# EAGLE schematic pic32ak_fe (EAGLE 9.6.2)
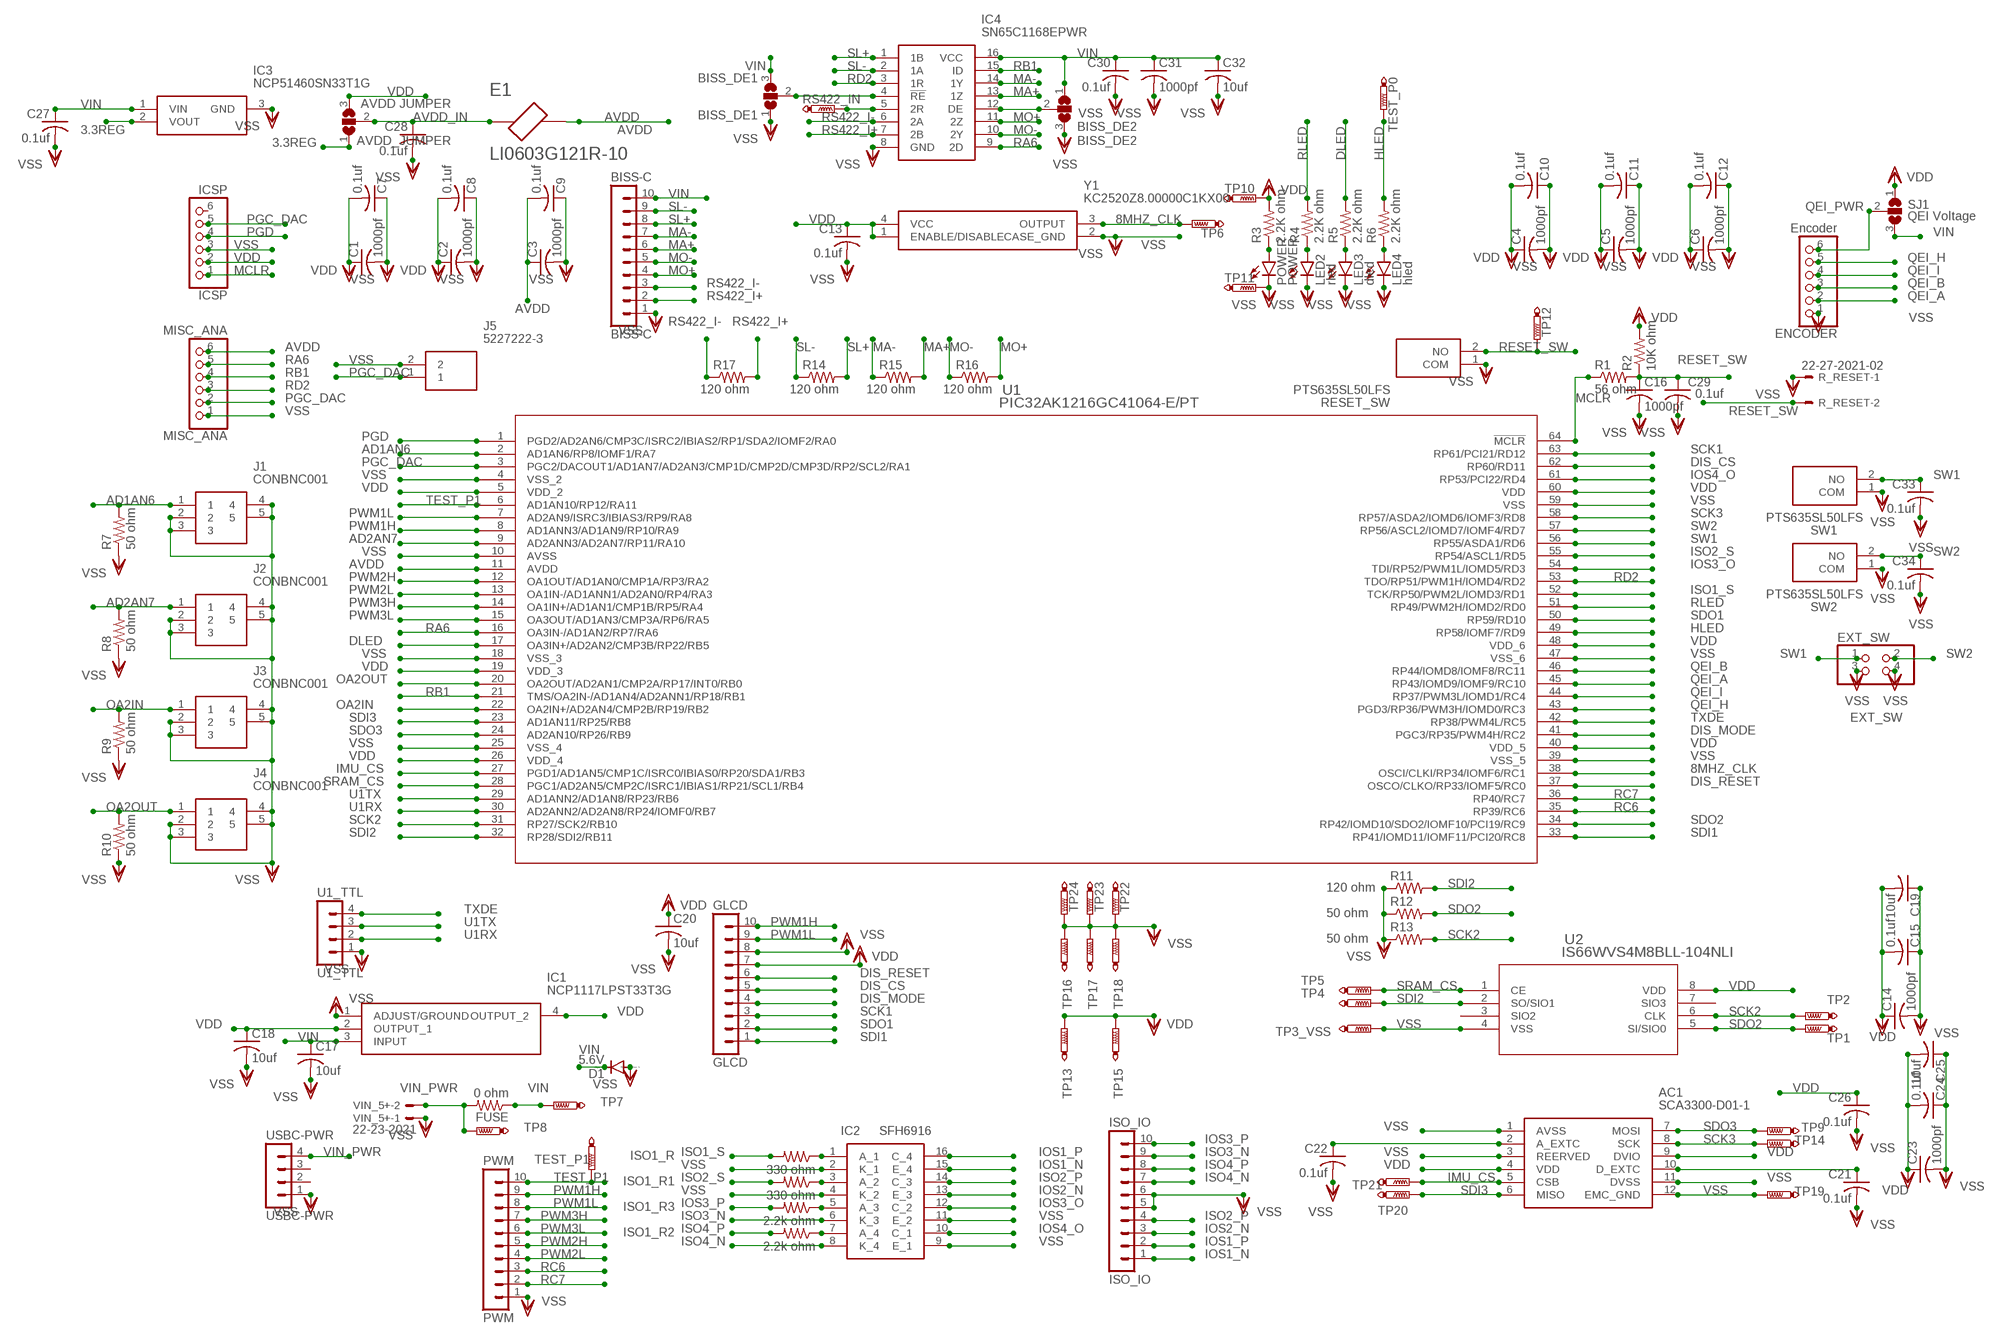
[diagram p0: schematic, sheet 1]

## Parts
AC1  SCA3300-D01-1  [SCA3300]
AVDD_JUMPER  AVDD JUMPER  SJ2W  [SJ_2]
BISS-C  BISS-C  MA10-1  [MA10-1]
BISS_DE1  BISS_DE1  SJ2W  [SJ_2]
BISS_DE2  BISS_DE2  SJ2W  [SJ_2]
C1  1000pf  C-USC0603  [C0603]
C2  1000pf  C-USC0603  [C0603]
C3  1000pf  C-USC0603  [C0603]
C4  1000pf  C-USC0603  [C0603]
C5  1000pf  C-USC0603  [C0603]
C6  1000pf  C-USC0603  [C0603]
C7  0.1uf  C-USC0603  [C0603]
C8  0.1uf  C-USC0603  [C0603]
C9  0.1uf  C-USC0603  [C0603]
C10  0.1uf  C-USC0603  [C0603]
C11  0.1uf  C-USC0603  [C0603]
C12  0.1uf  C-USC0603  [C0603]
C13  0.1uf  C-USC0603  [C0603]
C14  1000pf  C-USC0603  [C0603]
C15  0.1uf  C-USC0603  [C0603]
C16  1000pf  C-USC0603  [C0603]
C17  10uf  C-USC0805  [C0805]
C18  10uf  C-USC0805  [C0805]
C19  10uf  C-USC0805  [C0805]
C20  10uf  C-USC0805  [C0805]
C21  0.1uf  C-USC0603  [C0603]
C22  0.1uf  C-USC0603  [C0603]
C23  1000pf  C-USC0603  [C0603]
C24  0.1uf  C-USC0603  [C0603]
C25  10uf  C-USC0805  [C0805]
C26  0.1uf  C-USC0603  [C0603]
C27  0.1uf  C-USC0603  [C0603]
C28  0.1uf  C-USC0603  [C0603]
C29  0.1uf  C-USC0603  [C0603]
C30  0.1uf  C-USC0603  [C0603]
C31  1000pf  C-USC0603  [C0603]
C32  10uf  C-USC0805  [C0805]
C33  0.1uf  C-USC0603  [C0603]
C34  0.1uf  C-USC0603  [C0603]
D1  5.6V  DIODE-SMB  [SMB]
E1  LI0603G121R-10  [FB_LI0603G121R-10]
ENCODER  Encoder  PINHD-1X6/90  [1X06/90]
EXT_SW  EXT_SW  PINHD-2X2  [2X02]
FUSE  0 ohm  R-US_R0805  [R0805]
GLCD  GLCD  MA10-1  [MA10-1]
IC1  NCP1117LPST33T3G  [SOT230P700X180-4N]
IC2  SFH6916  [SOIC127P700X230-16N]
IC3  NCP51460SN33T1G  [SOT96P237X111-3N]
IC4  SN65C1168EPWR  [SOP65P640X120-16N]
ICSP  ICSP  PINHD-1X6/90  [1X06/90]
ISO1_R  330 ohm  R-US_R0805  [R0805]
ISO1_R1  330 ohm  R-US_R0805  [R0805]
ISO1_R2  2.2k ohm  R-US_R0805  [R0805]
ISO1_R3  2.2k ohm  R-US_R0805  [R0805]
ISO_IO  ISO_IO  MA10-1  [MA10-1]
J1  CONBNC001  [CONBNC001]
J2  CONBNC001  [CONBNC001]
J3  CONBNC001  [CONBNC001]
J4  CONBNC001  [CONBNC001]
J5  5227222-3  [52272223]
LED2  rled  LEDCHIP-LED0603  [CHIP-LED0603]
LED3  dled  LEDCHIP-LED0603  [CHIP-LED0603]
LED4  hled  LEDCHIP-LED0603  [CHIP-LED0603]
MISC_ANA  MISC_ANA  PINHD-1X6/90  [1X06/90]
POWER  POWER  LEDCHIP-LED0603  [CHIP-LED0603]
PWM  PWM  MA10-1  [MA10-1]
R1  56 ohm  R-US_R0805  [R0805]
R2  10K ohm  R-US_R0805  [R0805]
R3  2.2K ohm  R-US_R0805  [R0805]
R4  2.2K ohm  R-US_R0805  [R0805]
R5  2.2K ohm  R-US_R0805  [R0805]
R6  2.2K ohm  R-US_R0805  [R0805]
R7  50 ohm  R-US_R0805  [R0805]
R8  50 ohm  R-US_R0805  [R0805]
R9  50 ohm  R-US_R0805  [R0805]
R10  50 ohm  R-US_R0805  [R0805]
R11  120 ohm  R-US_R0603  [R0603]
R12  50 ohm  R-US_R0603  [R0603]
R13  50 ohm  R-US_R0603  [R0603]
R14  120 ohm  R-US_R0603  [R0603]
R15  120 ohm  R-US_R0603  [R0603]
R16  120 ohm  R-US_R0603  [R0603]
R17  120 ohm  R-US_R0603  [R0603]
R_RESET  22-27-2021-02  [6410-02]
RESET_SW  PTS635SL50LFS  [PTS635SL50LFS]
RS422_IN  PTR1PAD1-13  [P1-13]
SJ1  QEI Voltage  SJ2W  [SJ_2]
SW1  PTS635SL50LFS  [PTS635SL50LFS]
SW2  PTS635SL50LFS  [PTS635SL50LFS]
TEST_P0  PTR1PAD1-20  [P1-20]
TEST_P1  PTR1PAD1-20  [P1-20]
TP1  PTR1PAD1-13  [P1-13]
TP2  PTR1PAD1-13  [P1-13]
TP3_VSS  PTR1PAD1-13  [P1-13]
TP4  PTR1PAD1-13  [P1-13]
TP5  PTR1PAD1-13  [P1-13]
TP6  PTR1PAD1-13  [P1-13]
TP7  PTR1PAD1-13  [P1-13]
TP8  PTR1PAD1-13  [P1-13]
TP9  PTR1PAD1-13  [P1-13]
TP10  PTR1PAD1-20  [P1-20]
TP11  PTR1PAD1-20  [P1-20]
TP12  PTR1PAD1-20  [P1-20]
TP13  PTR1PAD1-13  [P1-13]
TP14  PTR1PAD1-13  [P1-13]
TP15  PTR1PAD1-13  [P1-13]
TP16  PTR1PAD1-13  [P1-13]
TP17  PTR1PAD1-13  [P1-13]
TP18  PTR1PAD1-13  [P1-13]
TP19  PTR1PAD1-13  [P1-13]
TP20  PTR1PAD1-13  [P1-13]
TP21  PTR1PAD1-13  [P1-13]
TP22  PTR1PAD1-13  [P1-13]
TP23  PTR1PAD1-13  [P1-13]
TP24  PTR1PAD1-13  [P1-13]
U1  PIC32AK1216GC41064-E/PT  [TQFP64_PT_MCH]
U1_TTL  U1_TTL  MA04-1  [MA04-1]
U2  IS66WVS4M8BLL-104NLI  [SOIC8_150MIL_N_ISI]
USBC-PWR  USBC-PWR  MA04-1  [MA04-1]
VIN_5+  22-23-2021  [22-23-2021]
Y1  KC2520Z8.00000C1KX00  [KC2520Z800000C1KX00]

## Nets
3.3REG [current]: AVDD_JUMPER.1 IC3.2(VOUT)
8MHZ_CLK: TP6.TP U1.38(OSCI/CLKI/RP34/IOMF6/RC1) Y1.3(OUTPUT)
AD1AN6: J1.1 R7.2 U1.2(AD1AN6/RP8/IOMF1/RA7)
AD2AN7: J2.1 R8.2 U1.9(AD2ANN3/AD2AN7/RP11/RA10)
AVDD [current]: C3.1 C9.2 E1.2 MISC_ANA.6 U1.11(AVDD)
AVDD_IN [current]: AVDD_JUMPER.2 C28.1 E1.1
DIS_CS: GLCD.5 U1.62(RP60/RD11)
DIS_MODE: GLCD.4 U1.41(PGC3/RP35/PWM4H/RC2)
DIS_RESET: GLCD.6 U1.37(OSCO/CLKO/RP33/IOMF5/RC0)
DLED: R5.2 U1.17(OA3IN+/AD2AN2/CMP3B/RP22/RB5)
HLED: R6.2 TEST_P0.TP U1.49(RP58/IOMF7/RD9)
IMU_CS: AC1.5(CSB) TP21.TP U1.27(PGD1/AD1AN5/CMP1C/ISRC0/IBIAS0/RP20/SDA1/RB3)
IOS1_N: IC2.15(E_4) ISO_IO.1
IOS1_P: IC2.16(C_4) ISO_IO.2
IOS2_N: IC2.13(E_3) ISO_IO.3
IOS3_O: IC2.12(C_2) U1.54(TDI/RP52/PWM1L/IOMD5/RD3)
IOS3_P: ISO1_R3.2 ISO_IO.10
IOS4_O: IC2.10(C_1) U1.61(RP53/PCI22/RD4)
ISO1_S: ISO1_R.2 U1.52(TCK/RP50/PWM2L/IOMD3/RD1)
ISO2_P: IC2.14(C_3) ISO_IO.4
ISO2_S: ISO1_R1.2 U1.55(RP54/ASCL1/RD5)
ISO3_N: IC2.6(K_3) ISO_IO.9
ISO4_N: IC2.8(K_4) ISO_IO.7
ISO4_P: ISO1_R2.2 ISO_IO.8
MA+: BISS-C.6 IC4.13(1Z) R15.2
MA-: BISS-C.7 IC4.14(1Y) R15.1
MCLR: ICSP.1 R1.1 U1.64(!MCLR)
MO+: BISS-C.4 IC4.11(2Z) R16.2
MO-: BISS-C.5 IC4.10(2Y) R16.1
N$1: AC1.2(A_EXTC) C22.1
N$2: POWER.A R3.1
N$3: LED2.A R4.1
N$4: LED3.A R5.1
N$5: LED4.A R6.1
N$6: AC1.10(D_EXTC) C21.1
N$7: IC2.1(A_1) ISO1_R.1
N$8: IC2.3(A_2) ISO1_R1.1
N$9: IC2.5(A_3) ISO1_R3.1
N$10: IC2.7(A_4) ISO1_R2.1
N$11: BISS_DE1.2 IC4.4(!RE)
N$12: BISS_DE2.2 IC4.12(DE)
N$19: IC4.5(2R) RS422_IN.TP
OA2IN: J3.1 R9.2 U1.22(OA2IN+/AD2AN4/CMP2B/RP19/RB2)
OA2OUT: J4.1 R10.2 U1.20(OA2OUT/AD2AN1/CMP2A/RP17/INT0/RB0)
PGC_DAC: ICSP.5 J5.1 MISC_ANA.2 U1.3(PGC2/DACOUT1/AD1AN7/AD2AN3/CMP1D/CMP2D/CMP3D/RP2/SCL2/RA1)
PGD: ICSP.4 U1.1(PGD2/AD2AN6/CMP3C/ISRC2/IBIAS2/RP1/SDA2/IOMF2/RA0)
PWM1H: GLCD.10 PWM.9 U1.8(AD1ANN3/AD1AN9/RP10/RA9)
PWM1L: GLCD.9 PWM.8 U1.7(AD2AN9/ISRC3/IBIAS3/RP9/RA8)
PWM2H: PWM.5 U1.12(OA1OUT/AD1AN0/CMP1A/RP3/RA2)
PWM2L: PWM.4 U1.13(OA1IN-/AD1ANN1/AD2AN0/RP4/RA3)
PWM3H: PWM.7 U1.14(OA1IN+/AD1AN1/CMP1B/RP5/RA4)
PWM3L: PWM.6 U1.15(OA3OUT/AD1AN3/CMP3A/RP6/RA5)
QEI_A: ENCODER.2 U1.45(RP43/IOMD9/IOMF9/RC10)
QEI_B: ENCODER.3 U1.46(RP44/IOMD8/IOMF8/RC11)
QEI_H: ENCODER.5 U1.43(PGD3/RP36/PWM3H/IOMD0/RC3)
QEI_I: ENCODER.4 U1.44(RP37/PWM3L/IOMD1/RC4)
QEI_PWR [current]: ENCODER.6 SJ1.2
RA6: IC4.9(2D) MISC_ANA.5 U1.16(OA3IN-/AD1AN2/RP7/RA6)
RB1: IC4.15(ID) MISC_ANA.4 U1.21(TMS/OA2IN-/AD1AN4/AD2ANN1/RP18/RB1)
RC6: PWM.3 U1.35(RP39/RC6)
RC7: PWM.2 U1.36(RP40/RC7)
RD2: IC4.3(1R) MISC_ANA.3 U1.53(TDO/RP51/PWM1H/IOMD4/RD2)
RESET_SW: C16.1 C29.1 R1.2 R2.1 R_RESET.2 RESET_SW.2(NO) TP12.TP
RLED: R4.2 U1.51(RP49/PWM2H/IOMD2/RD0)
RS422_I+: BISS-C.2 IC4.7(2B) R17.2
RS422_I-: BISS-C.3 IC4.6(2A) R17.1
SCK1: GLCD.3 U1.63(RP61/PCI21/RD12)
SCK2: R13.2 TP2.TP U1.31(RP27/SCK2/RB10) U2.6(CLK)
SCK3: AC1.8(SCK) TP14.TP U1.58(RP57/ASDA2/IOMD6/IOMF3/RD8)
SDI1: GLCD.1 U1.33(RP41/IOMD11/IOMF11/PCI20/RC8)
SDI2: R11.2 TP4.TP U1.32(RP28/SDI2/RB11) U2.2(SO/SIO1)
SDI3: AC1.6(MISO) TP20.TP U1.23(AD1AN11/RP25/RB8)
SDO1: GLCD.2 U1.50(RP59/RD10)
SDO2: R12.2 TP1.TP U1.34(RP42/IOMD10/SDO2/IOMF10/PCI19/RC9) U2.5(SI/SIO0)
SDO3: AC1.7(MOSI) TP9.TP U1.24(AD2AN10/RP26/RB9)
SL+: BISS-C.8 IC4.1(1B) R14.2
SL-: BISS-C.9 IC4.2(1A) R14.1
SRAM_CS: TP5.TP U1.28(PGC1/AD2AN5/CMP2C/ISRC1/IBIAS1/RP21/SCL1/RB4) U2.1(CE)
SW1: C33.1 EXT_SW.1 SW1.2(NO) U1.56(RP55/ASDA1/RD6)
SW2: C34.1 EXT_SW.2 SW2.2(NO) U1.57(RP56/ASCL2/IOMD7/IOMF4/RD7)
TEST_P1: PWM.10 TEST_P1.TP U1.6(AD1AN10/RP12/RA11)
TXDE: U1.42(RP38/PWM4L/RC5) U1_TTL.4
U1RX: U1.30(AD2ANN2/AD2AN8/RP24/IOMF0/RB7) U1_TTL.2
U1TX: U1.29(AD1ANN2/AD1AN8/RP23/RB6) U1_TTL.3
VDD [current]: AC1.4(VDD) AC1.9(DVIO) AVDD_JUMPER.3 C1.1 C2.1 C4.1 C5.1 C6.1 C7.2 C8.2 C10.2 C11.2 C12.2 C13.1 C14.1 C15.2 C18.1 C19.2 C20.1 C23.1 C24.2 C25.2 C26.1 GLCD.7 IC1.2(OUTPUT_1) IC1.4(OUTPUT_2) ICSP.2 R2.2 R3.2 SJ1.1 TP10.TP TP13.TP TP15.TP U1.5(VDD_2) U1.19(VDD_3) U1.26(VDD_4) U1.40(VDD_5) U1.48(VDD_6) U1.60(VDD) U2.8(VDD) Y1.1(ENABLE/DISABLE) Y1.4(VCC)
VIN [current]: BISS-C.10 BISS_DE1.3 BISS_DE2.1 C17.1 C27.1 C30.1 C31.1 C32.1 D1.C FUSE.1 IC1.3(INPUT) IC3.1(VIN) IC4.16(VCC) SJ1.3 TP7.TP
VIN_PWR [high_current]: FUSE.2 TP8.TP USBC-PWR.4 VIN_5+.2
VSS [current]: AC1.1(AVSS) AC1.3(REERVED) AC1.11(DVSS) AC1.12(EMC_GND) BISS-C.1 BISS_DE1.1 BISS_DE2.3 C1.2 C2.2 C3.2 C4.2 C5.2 C6.2 C7.1 C8.1 C9.1 C10.1 C11.1 C12.1 C13.2 C14.2 C15.1 C16.2 C17.2 C18.2 C19.1 C20.2 C21.2 C22.2 C23.2 C24.1 C25.1 C26.2 C27.2 C28.2 C29.2 C30.2 C31.2 C32.2 C33.2 C34.2 D1.A ENCODER.1 EXT_SW.3 EXT_SW.4 GLCD.8 IC1.1(ADJUST/GROUND) IC2.2(K_1) IC2.4(K_2) IC2.9(E_1) IC2.11(E_2) IC3.3(GND) IC4.8(GND) ICSP.3 ISO_IO.5 ISO_IO.6 J1.2 J1.3 J1.4 J1.5 J2.2 J2.3 J2.4 J2.5 J3.2 J3.3 J3.4 J3.5 J4.2 J4.3 J4.4 J4.5 J5.2 LED2.C LED3.C LED4.C MISC_ANA.1 POWER.C PWM.1 R7.1 R8.1 R9.1 R10.1 R11.1 R12.1 R13.1 R_RESET.1 RESET_SW.1(COM) SW1.1(COM) SW2.1(COM) TP3_VSS.TP TP11.TP TP16.TP TP17.TP TP18.TP TP19.TP TP22.TP TP23.TP TP24.TP U1.4(VSS_2) U1.10(AVSS) U1.18(VSS_3) U1.25(VSS_4) U1.39(VSS_5) U1.47(VSS_6) U1.59(VSS) U1_TTL.1 U2.4(VSS) USBC-PWR.1 VIN_5+.1 Y1.2(CASE_GND)
Unconnected: ICSP.6 U2.3(SIO2) U2.7(SIO3) USBC-PWR.2 USBC-PWR.3

## Library data of the parts
AC1 = SCA3300-D01-1:SCA3300-D01-1: Murata SCA3300-D01-1, 3-Axis Accelerometer, +/-1.5 +/-6g, 3 3.6 V, SPI, DFL/SMD 12-Pin Source: Datasheet <https://www.murata.com/~/media/webrenewal/products/sensor/accel/sca3300/sca3300-d01 industrial 3-axis accelerometer datasheet _a1.ashx> Check availability <https://pricing.snapeda.com/parts/SCA3300-D01-1/Murata%20Electronics/view-part?ref=eda>; AVAILABILITY: In Stock; DESCRIPTION: Accelerometer X, Y, Z Axis ±1.5g, 3g, 6g - -; MF: Murata Electronics; MP: SCA3300-D01-1; PACKAGE: Nonstandard Murata; PRICE: None; PURCHASE-URL: https://pricing.snapeda.com/search/part/SCA3300-D01-1/?ref=eda
AVDD_JUMPER BISS_DE1 BISS_DE2 SJ1 = jumper:SJ2W: SMD solder JUMPER
BISS-C GLCD ISO_IO PWM = con-lstb:MA10-1: PIN HEADER; OC_FARNELL: unknown; OC_NEWARK: unknown
C1-C34 = rcl:C-US: CAPACITOR, American symbol; SPICEPREFIX: C
D1 = diode:DIODE-: DIODE
E1 = LI0603G121R-10:LI0603G121R-10: Check availability <https://pricing.snapeda.com/parts/LI0603G121R-10/Laird/view-part?ref=eda>; AVAILABILITY: In Stock; CHECK_PRICES: https://www.snapeda.com/parts/LI0603G121R-10/Laird/view-part/?ref=eda; DESCRIPTION: EMI Ferrite Chip Bead, 0603, 700MA, 120 Ohms @100MHz, DCR Max 0.20Ohm | Laird Performance Materials LI0603G121R-10; MF: Laird; MP: LI0603G121R-10; PACKAGE: 0603 Laird; PRICE: None; SNAPEDA_LINK: https://www.snapeda.com/parts/LI0603G121R-10/Laird/view-part/?ref=snap
ENCODER ICSP MISC_ANA = pinhead:PINHD-1X6: PIN HEADER
EXT_SW = pinhead:PINHD-2X2: PIN HEADER
FUSE ISO1_R ISO1_R1-ISO1_R3 R1-R17 = rcl:R-US_: RESISTOR, American symbol; SPICEPREFIX: R
IC1 = NCP1117LPST33T3G:NCP1117LPST33T3G: Output Current in Excess of 1.0 A Source: Datasheet <https://www.onsemi.com/pub/Collateral/NCP1117LP-D.PDF>; DESCRIPTION: Output Current in Excess of 1.0 A; HEIGHT: 1.8mm; MANUFACTURER_NAME: onsemi; MANUFACTURER_PART_NUMBER: NCP1117LPST33T3G; MOUSER_PART_NUMBER: 863-NCP1117LPST33T3G; MOUSER_PRICE-STOCK: https://www.mouser.co.uk/ProductDetail/onsemi/NCP1117LPST33T3G?qs=kbSN2QblFfKG9A4Foh4YYg%3D%3D
IC2 = SFH6916:SFH6916: Optocoupler DC-IN 4-CH Trans DC-OUT Source: Datasheet <http://www.vishay.com/docs/83687/sfh6916.pdf>; DESCRIPTION: Optocoupler DC-IN 4-CH Trans DC-OUT; HEIGHT: 2.3mm; MANUFACTURER_NAME: Vishay; MANUFACTURER_PART_NUMBER: SFH6916; MOUSER_PART_NUMBER: 782-SFH6916; MOUSER_PRICE-STOCK: https://www.mouser.co.uk/ProductDetail/Vishay-Semiconductors/SFH6916?qs=xCMk%252BIHWTZMHOsdqeojy6Q%3D%3D
IC3 = NCP51460SN33T1G:NCP51460SN33T1G: Operating Input Voltage VIN 4.2 V to 28 V; Output Current Capability of 0 to 20 mA; Output Voltage Temperature Coefficient of 18 ppm/C; Output Voltage Accuracy 1 %, for 0 C TA 100 C ; High PSRR of 68 dB at 1 kHz; Stable Without Output Capacitor; Low Quiescent Current of 140 A; Low Output Noise of 18 VRMS; Output Voltage Option: 3.3V Source: Datasheet <https://www.onsemi.com/pub/Collateral/NCP51460-D.PDF>; DESCRIPTION: Operating Input Voltage VIN 4.2 V to 28 V; Output Current Capability of 0 to 20 mA; Output Voltage Temperature Coefficient of 18 ppm/C; Output Voltage Accuracy 1 %, for 0 C TA 100 C ; High PSRR of 68 dB at 1 kHz; Stable Without Output Capacitor; Low Quiescent Current of 140 A; Low Output Noise of 18 VRMS; Output Voltage Option: 3.3V; HEIGHT: 1.11mm; MANUFACTURER_NAME: onsemi; MANUFACTURER_PART_NUMBER: NCP51460SN33T1G; MOUSER_PART_NUMBER: 863-NCP51460SN33T1G; MOUSER_PRICE-STOCK: https://www.mouser.co.uk/ProductDetail/onsemi/NCP51460SN33T1G?qs=yYCK2ysgWqmLP%2FSKTB%252Bdng%3D%3D
IC4 = SN65C1168EPWR:SN65C1168EPWR: Dual Differential Drivers and Receivers With +/-15-kV IEC ESD Protection Source: Datasheet <http://www.ti.com/lit/gpn/sn65c1168e>; DESCRIPTION: Dual Differential Drivers and Receivers With +/-15-kV IEC ESD Protection; HEIGHT: 1.2mm; MANUFACTURER_NAME: Texas Instruments; MANUFACTURER_PART_NUMBER: SN65C1168EPWR; MOUSER_PART_NUMBER: 595-SN65C1168EPWR; MOUSER_PRICE-STOCK: https://www.mouser.co.uk/ProductDetail/Texas-Instruments/SN65C1168EPWR?qs=qRemG2J%252Bg%2FV5zfprVJi%2FKg%3D%3D
J1-J4 = CONBNC001:CONBNC001: Body Features: Body Material Brass | Body Plating Material Nickel | Configuration Features: Number of Coaxial Contacts 1 | Number of Positions 1 | Electrical Characteristics: Impedance 50 OHM | Mechanical Attachment: Connector Mounting Type Board Mount | RF Connector Coupling Mechanism Bayonet | Operation/Application: Operating Frequency 3 GHZ | Circuit Application Signal | Other: Dielectric Material Polytetrafluoroethylene (PTFE) | Product Type Features: RF Connector Style Jack | Connector & Contact Termin Source: Datasheet <https://www.te.com/commerce/DocumentDelivery/DDEController?Action=srchrtrv&DocNm=CONBNC001&DocType=Data Sheet&DocLang=English&PartCntxt=CONBNC001&DocFormat=pdf>; DESCRIPTION: Body Features: Body Material Brass | Body Plating Material Nickel | Configuration Features: Number of Coaxial Contacts 1 | Number of Positions 1 | Electrical Characteristics: Impedance 50 OHM | Mechanical Attachment: Connector Mounting Type Board Mount | RF Connector Coupling Mechanism Bayonet | Operation/Application: Operating Frequency 3 GHZ | Circuit Application Signal | Other: Dielectric Material Polytetrafluoroethylene (PTFE) | Product Type Features: RF Connector Style Jack | Connector & Contact Termin; HEIGHT: 14.9mm; MANUFACTURER_NAME: TE Connectivity; MANUFACTURER_PART_NUMBER: CONBNC001; MOUSER_PART_NUMBER: 712-CONBNC001; MOUSER_PRICE-STOCK: https://www.mouser.co.uk/ProductDetail/TE-Connectivity-Linx-Technologies/CONBNC001?qs=doiCPypUmgHczHAGaJs8Lg%3D%3D
J5 = 5227222-3:5227222-3: Body Features: Body Material Finish Passivated | Body Plating Material Nickel | Body Material Polyester, PBT | Configuration Features: Number of Coaxial Contacts 1 | PCB Mount Orientation Vertical | Number of Positions 1 | Contact Features: RF Connector Center Contact Material Phosphor Bronze | RF Connector Center Contact Plating Thickness 889 MICIN | RF Connector Center Contact Underplating Material Nickel | RF Connector Center Contact Plating Material Gold | Dimensions: Profile Height from PCB 1.375 INCH Source: Datasheet <https://www.te.com/commerce/DocumentDelivery/DDEController?Action=srchrtrv&DocNm=1307191_BNC_Connectors&DocType=Catalog Section&DocLang=English&PartCntxt=5227222-3&DocFormat=pdf>; DESCRIPTION: Body Features: Body Material Finish Passivated | Body Plating Material Nickel | Body Material Polyester, PBT | Configuration Features: Number of Coaxial Contacts 1 | PCB Mount Orientation Vertical | Number of Positions 1 | Contact Features: RF Connector Center Contact Material Phosphor Bronze | RF Connector Center Contact Plating Thickness 889 MICIN | RF Connector Center Contact Underplating Material Nickel | RF Connector Center Contact Plating Material Gold | Dimensions: Profile Height from PCB 1.375 INCH; HEIGHT: 35.57mm; MANUFACTURER_NAME: TE Connectivity; MANUFACTURER_PART_NUMBER: 5227222-3; MOUSER_PART_NUMBER: 571-5227222-3; MOUSER_PRICE-STOCK: https://www.mouser.co.uk/ProductDetail/TE-Connectivity/5227222-3?qs=GSeC4G%252BEqEW87SYw9J0%252BtA%3D%3D
LED2-LED4 POWER = led:LED: LED OSRAM: - CHIPLED LG R971, LG N971, LY N971, LG Q971, LY Q971, LO R971, LY R971 LH N974, LH R974 LS Q976, LO Q976, LY Q976 LO Q996 - Hyper CHIPLED LW Q18S LB Q993, LB Q99A, LB R99A - SideLED LS A670, LO A670, LY A670, LG A670, LP A670 LB A673, LV A673, LT A673, LW A673 LH A674 LY A675 LS A676, LA A676, LO A676, LY A676, LW A676 LS A679, LY A679, LG A679 - Hyper Micro SIDELED® LS Y876, LA Y876, LO Y876, LY Y876 LT Y87S - SmartLED LW L88C, LW L88S LB L89C, LB L89S, LG L890 LS L89K, LO L89K, LY L89K LS L896, LA L896, LO L896, LY L896 - TOPLED LS T670, LO T670, LY T670, LG T670, LP T670 LSG T670, LSP T670, LSY T670, LOP T670, LYG T670 LG T671, LOG T671, LSG T671 LB T673, LV T673, LT T673, LW T673 LH T674 LS T676, LA T676, LO T676, LY T676, LB T676, LH T676, LSB T676, LW T676 LB T67C, LV T67C, LT T67C, LS T67K, LO T67K, LY T67K, LW E67C LS E67B, LA E67B, LO E67B, LY E67B, LB E67C, LV E67C, LT E67C LW T67C LS T679, LY T679, LG T679 LS T770, LO T770, LY T770, LG T770, LP T770 LB T773, LV T773, LT T773, LW T773 LH T774 LS E675, LA E675, LY E675, LS T675 LS T776, LA T776, LO T776, LY T776, LB T776 LHGB T686 LT T68C, LB T68C - Hyper Mini TOPLED® LB M676 - Mini TOPLED Santana® LG M470 LS M47K, LO M47K, LY M47K Source: http://www.osram.convergy.de LUXEON: - LUMILED® LXK2-PW12-R00, LXK2-PW12-S00, LXK2-PW14-U00, LXK2-PW14-V00 LXK2-PM12-R00, LXK2-PM12-S00, LXK2-PM14-U00 LXK2-PE12-Q00, LXK2-PE12-R00, LXK2-PE12-S00, LXK2-PE14-T00, LXK2-PE14-U00 LXK2-PB12-K00, LXK2-PB12-L00, LXK2-PB12-M00, LXK2-PB14-N00, LXK2-PB14-P00, LXK2-PB14-Q00 LXK2-PR12-L00, LXK2-PR12-M00, LXK2-PR14-Q00, LXK2-PR14-R00 LXK2-PD12-Q00, LXK2-PD12-R00, LXK2-PD12-S00 LXK2-PH12-R00, LXK2-PH12-S00 LXK2-PL12-P00, LXK2-PL12-Q00, LXK2-PL12-R00 Source: www.luxeon.com KINGBRIGHT: KA-3528ASYC Source: www.kingbright.com
R_RESET = con-molex:22-?-02: CONNECTOR wire to board 2.54 mm (.1 inch) pitch header; MF: MOLEX; OC_FARNELL: unknown; OC_NEWARK: unknown
RESET_SW SW1 SW2 = PTS635SL50LFS:PTS635SL50LFS: Tactile Switches TACT Source: Datasheet; DESCRIPTION: Tactile Switches TACT; HEIGHT: 5mm; MANUFACTURER_NAME: C & K COMPONENTS; MANUFACTURER_PART_NUMBER: PTS635SL50LFS; MOUSER_PART_NUMBER: 611-PTS635SL50LFS; MOUSER_PRICE-STOCK: https://www.mouser.co.uk/ProductDetail/CK/PTS635SL50LFS?qs=u2NJ%252B70r0gpkXWlfBVOo5A%3D%3D
RS422_IN TEST_P0 TEST_P1 TP1 TP2 TP3_VSS TP4-TP24 = testpad:PTR1: TEST PIN
U1 = pic32A:PIC32AK1216GC41064-E/PT; COPYRIGHT: Copyright (C) 2025 Ultra Librarian. All rights reserved.; MANUFACTURER_NAME: Microchip; MANUFACTURER_PART_NUMBER: PIC32AK1216GC41064-E/PT
U1_TTL USBC-PWR = con-lstb:MA04-1: PIN HEADER; OC_FARNELL: unknown; OC_NEWARK: unknown
U2 = iss66:IS66WVS4M8BLL-104NLI; COPYRIGHT: Copyright (C) 2025 Ultra Librarian. All rights reserved.; MANUFACTURER_NAME: ISSI; MANUFACTURER_PART_NUMBER: IS66WVS4M8BLL-104NLI; TYPE: Memory
VIN_5+ = con-molex:22-23-2021: .100" (2.54mm) Center Header - 2 Pin; MF: MOLEX; MPN: 22-23-2021; OC_FARNELL: 1462926; OC_NEWARK: 25C3832
Y1 = KC2520Z8.00000C1KX00:KC2520Z8.00000C1KX00: Standard Clock Oscillators 8 MHz 20 PPM 15 pF Source: Datasheet <https://componentsearchengine.com/Datasheets/1/KC2520Z8.00000C1KX00.pdf>; DESCRIPTION: Standard Clock Oscillators 8 MHz 20 PPM 15 pF; HEIGHT: 0.8mm; MANUFACTURER_NAME: Kyocera AVX; MANUFACTURER_PART_NUMBER: KC2520Z8.00000C1KX00; MOUSER_PART_NUMBER: 581-KC2520Z800C1KX00; MOUSER_PRICE-STOCK: https://www.mouser.co.uk/ProductDetail/KYOCERA-AVX/KC2520Z8.00000C1KX00?qs=rrS6PyfT74cbg89ZqaPNCA%3D%3D

## Net classes
1 current: width 0.203 mm
2 high_current: width 0.305 mm